# EAGLE design FT232 (EAGLE 5.06)
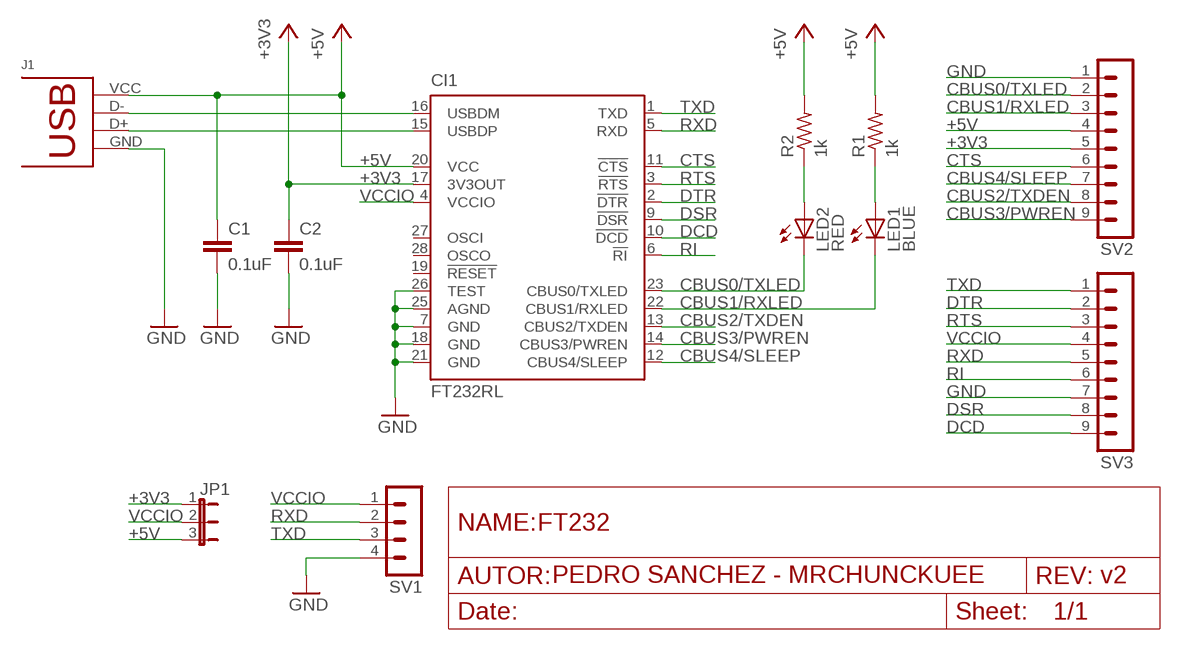
[diagram p0: schematic, sheet 1]

## Parts
C1  0.1uF  C-EUC1206  [C1206]
C2  0.1uF  C-EUC1206  [C1206]
CI1  FT232RL  [SSOP28]
J1  MINI-USB  [UX60-MB-5S8]
JP1  JP2E  [JP2]
LED1  BLUE  LEDSMT1206  [1206]
LED2  RED  LEDSMT1206  [1206]
R1  1k  R-US_R1206  [R1206]
R2  1k  R-US_R1206  [R1206]
SV1  MA04-1  [MA04-1]
SV2  MA09-1  [MA09-1]
SV3  MA09-1  [MA09-1]

## Nets
+3V3: C2.1 CI1.17(3V3OUT) JP1.1 SV2.5
+5V: C1.1 CI1.20(VCC) J1.VCC JP1.3 R1.2 R2.2 SV2.4
CBUS0/TXLED: CI1.23(CBUS0/TXLED) LED2.C SV2.2
CBUS1/RXLED: CI1.22(CBUS1/RXLED) LED1.C SV2.3
CBUS2/TXDEN: CI1.13(CBUS2/TXDEN) SV2.8
CBUS3/PWREN: CI1.14(CBUS3/PWREN) SV2.9
CBUS4/SLEEP: CI1.12(CBUS4/SLEEP) SV2.7
CTS: CI1.11(!CTS) SV2.6
DCD: CI1.10(!DCD) SV3.9
DSR: CI1.9(!DSR) SV3.8
DTR: CI1.2(!DTR) SV3.2
GND: C1.2 C2.2 CI1.7(GND) CI1.18(GND) CI1.21(GND) CI1.25(AGND) CI1.26(TEST) J1.GND SV1.4 SV2.1 SV3.7
N$1: LED1.A R1.1
N$2: LED2.A R2.1
N$3: CI1.16(USBDM) J1.D-
N$4: CI1.15(USBDP) J1.D+
RI: CI1.6(!RI) SV3.6
RTS: CI1.3(!RTS) SV3.3
RXD: CI1.5(RXD) SV1.2 SV3.5
TXD: CI1.1(TXD) SV1.3 SV3.1
VCCIO: CI1.4(VCCIO) JP1.2 SV1.1 SV3.4
Unconnected: CI1.19(!RESET) CI1.27(OSCI) CI1.28(OSCO)

## Notes on the sheet
- v2

## Library data of the parts
C1 C2 = rcl:C-EU: CAPACITOR, European symbol
CI1 = 1 ELECTRÓNICA Y ROBÓTICA:FT232R: FT232R USB to Serial
J1 = MINI-USB:MINI-USB: MINI USB Conector
JP1 = jumper:JP2E: JUMPER
LED1 LED2 = led:LED: LED OSRAM: - CHIPLED LG R971, LG N971, LY N971, LG Q971, LY Q971, LO R971, LY R971 LH N974, LH R974 LS Q976, LO Q976, LY Q976 LO Q996 - Hyper CHIPLED LW Q18S LB Q993, LB Q99A, LB R99A - SideLED LS A670, LO A670, LY A670, LG A670, LP A670 LB A673, LV A673, LT A673, LW A673 LH A674 LY A675 LS A676, LA A676, LO A676, LY A676, LW A676 LS A679, LY A679, LG A679 - Hyper Micro SIDELED® LS Y876, LA Y876, LO Y876, LY Y876 LT Y87S - SmartLED LW L88C, LW L88S LB L89C, LB L89S, LG L890 LS L89K, LO L89K, LY L89K LS L896, LA L896, LO L896, LY L896 - TOPLED LS T670, LO T670, LY T670, LG T670, LP T670 LSG T670, LSP T670, LSY T670, LOP T670, LYG T670 LG T671, LOG T671, LSG T671 LB T673, LV T673, LT T673, LW T673 LH T674 LS T676, LA T676, LO T676, LY T676, LB T676, LH T676, LSB T676, LW T676 LB T67C, LV T67C, LT T67C, LS T67K, LO T67K, LY T67K, LW E67C LS E67B, LA E67B, LO E67B, LY E67B, LB E67C, LV E67C, LT E67C LW T67C LS T679, LY T679, LG T679 LS T770, LO T770, LY T770, LG T770, LP T770 LB T773, LV T773, LT T773, LW T773 LH T774 LS E675, LA E675, LY E675, LS T675 LS T776, LA T776, LO T776, LY T776, LB T776 LHGB T686 LT T68C, LB T68C - Hyper Mini TOPLED® LB M676 - Mini TOPLED Santana® LG M470 LS M47K, LO M47K, LY M47K Source: http://www.osram.convergy.de LUXEON: - LUMILED® LXK2-PW12-R00, LXK2-PW12-S00, LXK2-PW14-U00, LXK2-PW14-V00 LXK2-PM12-R00, LXK2-PM12-S00, LXK2-PM14-U00 LXK2-PE12-Q00, LXK2-PE12-R00, LXK2-PE12-S00, LXK2-PE14-T00, LXK2-PE14-U00 LXK2-PB12-K00, LXK2-PB12-L00, LXK2-PB12-M00, LXK2-PB14-N00, LXK2-PB14-P00, LXK2-PB14-Q00 LXK2-PR12-L00, LXK2-PR12-M00, LXK2-PR14-Q00, LXK2-PR14-R00 LXK2-PD12-Q00, LXK2-PD12-R00, LXK2-PD12-S00 LXK2-PH12-R00, LXK2-PH12-S00 LXK2-PL12-P00, LXK2-PL12-Q00, LXK2-PL12-R00 Source: www.luxeon.com KINGBRIGHT: KA-3528ASYC Source: www.kingbright.com
R1 R2 = rcl:R-US_: RESISTOR, American symbol
SV1 = con-lstb:MA04-1: PIN HEADER
SV2 SV3 = con-lstb:MA09-1: PIN HEADER

## Board
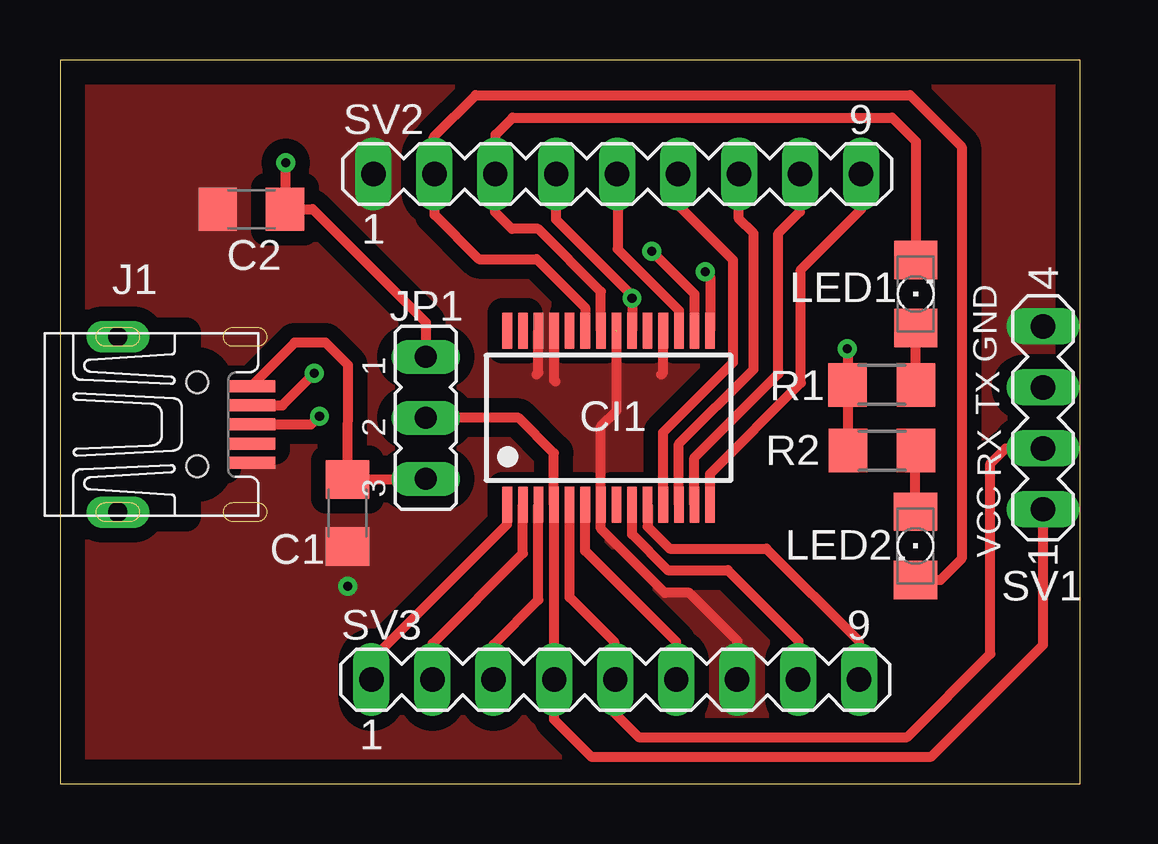
[diagram p1: board, top side]
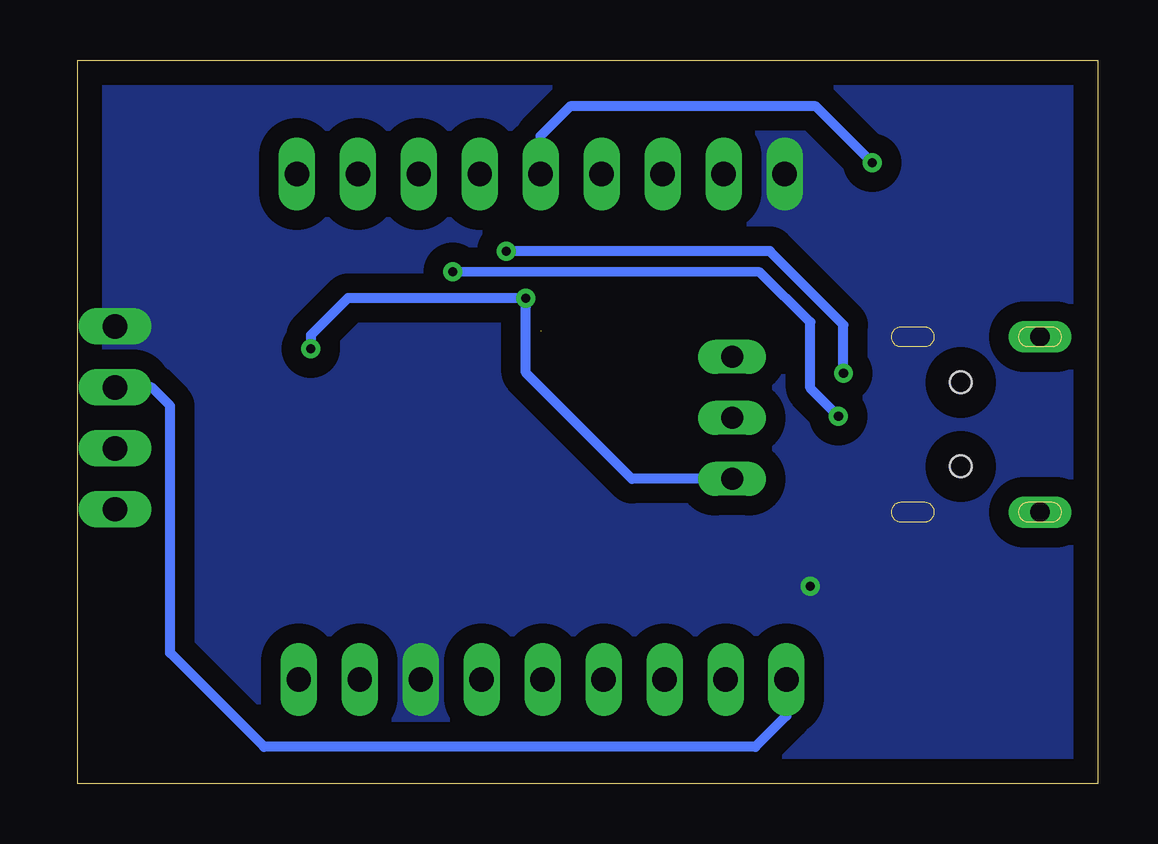
[diagram p2: board, bottom side, seen from below]

Size 42.52 x 30.15 mm. Coordinates in mm from the lower left corner, seen from the top.
Outline: 0,0 42.52,0 42.52,30.15 0,30.15 0,0
Copper layers (1*16): Top 0.035mm / dielectric 1.5mm / Bottom 0.035mm
Design rules "default": minimum track width 10mil, minimum drill 24mil, track to track 8mil, track to pad 8mil, pad to pad 8mil, via to via 8mil, smd to smd 8mil, copper to edge 40mil, drill to drill 8mil, minimum pad ring 10mil, minimum via ring 8mil, stop-mask expansion 4mil, vias tented up to drill 0mil, thermal gap 10mil

### Footprints (pad centres in the part's own frame; a part is rotated, then mirrored left to right if it is on the bottom)
C1206 = smd 1.6 x 1.8: 1 -1.4,0; 2 1.4,0
SSOP28 = smd 0.4 x 1.5: 1 -4.225,-3.625; 2 -3.575,-3.625; 3 -2.925,-3.625; 4 -2.275,-3.625; 5 -1.625,-3.625; 6 -0.975,-3.625; 7 -0.325,-3.625; 8 0.325,-3.625; 9 0.975,-3.625; 10 1.625,-3.625; 11 2.275,-3.625; 12 2.925,-3.625; 13 3.575,-3.625; 14 4.225,-3.625; 15 4.225,3.625; 16 3.575,3.625; 17 2.925,3.625; 18 2.275,3.625; 19 1.625,3.625; 20 0.975,3.625; 21 0.325,3.625; 22 -0.325,3.625; 23 -0.975,3.625; 24 -1.625,3.625; 25 -2.275,3.625; 26 -2.925,3.625; 27 -3.575,3.625; 28 -4.225,3.625
UX60-MB-5S8 = smd 2 x 0.5: D+ 8.65,0; D- 8.65,0.8; GND 8.65,-1.6; NC 8.65,-0.8; VCC 8.65,1.6 | drill 0.8 long: M1 3.1,-3.65; M2 3.1,3.65 | hole 0.9: 6.4,-1.75; 6.4,1.75
JP2 = drill 0.914 long: 1 -2.54,0; 2 0,0; 3 2.54,0
1206 = smd 1.6 x 1.803: A -1.422,0; C 1.422,0
R1206 = smd 1.6 x 1.803: 1 -1.422,0; 2 1.422,0
MA04-1 = drill 1.016 long: 1 -3.81,0; 2 -1.27,0; 3 1.27,0; 4 3.81,0
MA09-1 = drill 1.016 long: 1 -10.16,0; 2 -7.62,0; 3 -5.08,0; 4 -2.54,0; 5 0,0; 6 2.54,0; 7 5.08,0; 8 7.62,0; 9 10.16,0

### Placement (x,y rotation side)
C1  11.98,11.28 270 top
C2  7.97,23.93 180 top
CI1  22.86,15.24 0 top
J1  -0.69,14.96 0 top
JP1  15.24,15.24 270 top
LED1  35.66,20.4 90 top
LED2  35.65,9.9 270 top
R1  34.24,16.61 180 top
R2  34.25,13.87 180 top
SV1  40.96,15.24 90 top
SV2  23.22,25.4 0 top
SV3  23.13,4.33 0 top

### Tracks (layer width: path | path; a pad name or v marks a point on that pad's centre or on a via)
+3V3  (via drill 0.38)
  Top 0.406: JP1.1 15.24,19.22 10.53,23.93 C2.1 9.4,23.96 v9.4,25.87 | CI1.17 25.79,19.72 23.23,22.27 23.23,25.39 SV2.5 | CI1.17
  Bottom 0.406: v9.4,25.87 11.75,28.21 21.99,28.21 23.23,26.97 23.23,25.41 SV2.5
+5V  (via drill 0.38)
  Top 0.406: R2.2 R1.2 32.82,18.1 v32.8,18.12 | v23.84,20.23 CI1.20 v23.84,20.23 | v23.84,20.23 23.84,20.33 20.67,23.5 SV2.4 | 15.29,12.65 JP1.3 15.22,12.68 C1.1 12.01,17.44 11.07,18.38 9.78,18.38 J1.VCC
  Bottom 0.406: JP1.3 19.41,12.7 23.84,17.12 23.84,19.87 v23.84,20.23 31.25,20.23 32.8,18.68 v32.8,18.12
CBUS0/TXLED
  Top 0.406: LED2.C 36.68,8.48 37.57,9.37 37.57,26.53 35.42,28.68 17.32,28.68 15.58,26.95 15.58,25.42 SV2.2 15.61,23.7 17.45,21.85 19.86,21.85 21.89,19.83 CI1.23
CBUS1/RXLED
  Top 0.406: CI1.22 22.54,20.5 19.92,23.11 18.83,23.11 18.12,23.82 18.12,25.39 SV2.3 18.15,25.42 18.15,27.04 18.86,27.75 34.67,27.75 35.66,26.76 LED1.C
CBUS2/TXDEN
  Top 0.406: CI1.13 26.43,13.58 29.93,17.07 29.93,22.92 30.83,23.82 30.83,25.39 SV2.8
CBUS3/PWREN
  Top 0.406: CI1.14 27.09,12.91 30.87,16.7 30.87,21.42 33.37,23.91 33.37,25.39 SV2.9
CBUS4/SLEEP
  Top 0.406: CI1.12 25.79,14.15 28.9,17.26 28.9,22.92 28.29,23.54 28.29,25.39 SV2.7
CTS
  Top 0.406: CI1.11 25.14,14.63 28.05,17.55 28.05,21.81 25.74,24.12 25.74,25.39 SV2.6
DCD
  Top 0.406: CI1.10 24.48,10.71 25.4,9.8 29.43,9.8 33.28,5.95 33.28,4.35 SV3.9
DSR
  Top 0.406: CI1.9 23.84,10.38 25.32,8.89 27.83,8.89 30.77,5.95 30.77,4.35 SV3.8
DTR
  Top 0.406: CI1.2 19.29,9.6 15.52,5.83 15.52,4.34 SV3.2
GND  (via drill 0.38)  (1 unrouted)
  Top 0.406: SV3.7 28.22,4.34 28.22,5.95 26.22,7.95 25.2,7.95 22.54,10.62 CI1.7 22.54,14.89 23.19,15.54 23.19,18.86 | CI1.18 25.14,17.13 25.05,17.04 | CI1.25 20.59,16.82 20.65,16.75 | CI1.26 19.93,17.12 19.86,17.05
  other vias: 11.99,8.23
  pour Bottom (isolate 0.813, no thermals): 0,30.48 42.7,30.4 42.7,-0.08 0,0
  pour Top (isolate 0.61, no thermals): 0,30.48 42.78,30.4 42.78,-0.08 0,0
  pour Top (no thermals): 19.73,19.62 20.79,19.62 20.79,17.06 19.73,17.06 19.73,17.12
N$1
  Top 0.406: LED1.A R1.1
N$2
  Top 0.406: LED2.A 35.65,13.85 R2.1
N$3  (via drill 0.38)
  Top 0.406: CI1.16 26.43,20.41 v24.66,22.18 | J1.D- 9.27,15.76 v10.6,17.09
  Bottom 0.406: v24.66,22.18 13.67,22.18 10.6,19.12 v10.6,17.09
N$4  (via drill 0.38)
  Top 0.406: CI1.15 27.09,21.13 v26.88,21.33 | J1.D+ 10.46,14.96 v10.81,15.31
  Bottom 0.406: v26.88,21.33 14.08,21.3 11.97,19.23 11.97,16.47 v10.81,15.31
RI
  Top 0.406: CI1.6 21.89,9.7 25.68,5.91 SV3.6 | SV3.6
RTS
  Top 0.406: CI1.3 19.93,7.66 18.07,5.79 18.07,4.35 SV3.3
RXD
  Top 0.406: CI1.5 21.23,7.76 23.09,5.91 | 23.09,5.91 23.09,4.38 SV3.5 | 23.09,5.91 23.09,2.96 24.11,1.94 35.3,1.94 38.76,5.41 38.76,13.33 39.41,13.97 SV1.2
TXD
  Top 0.406: CI1.1 18.64,10.8 12.97,5.14 SV3.1
  Bottom 0.406: SV1.3 39.43,16.51 38.65,15.74 38.65,5.45 34.74,1.53 14.27,1.53 12.97,2.82 SV3.1 | SV3.1
VCCIO
  Top 0.406: JP1.2 19.11,15.24 20.58,13.77 CI1.4 20.59,4.34 | 20.59,4.34 20.59,2.67 22.13,1.12 36.3,1.12 40.96,5.78 SV1.1 | 20.59,4.34 SV3.4

### Text on the board
tNames: GND | TX | RX | VCC